# EAGLE design C64_PS (EAGLE 9.5.2)
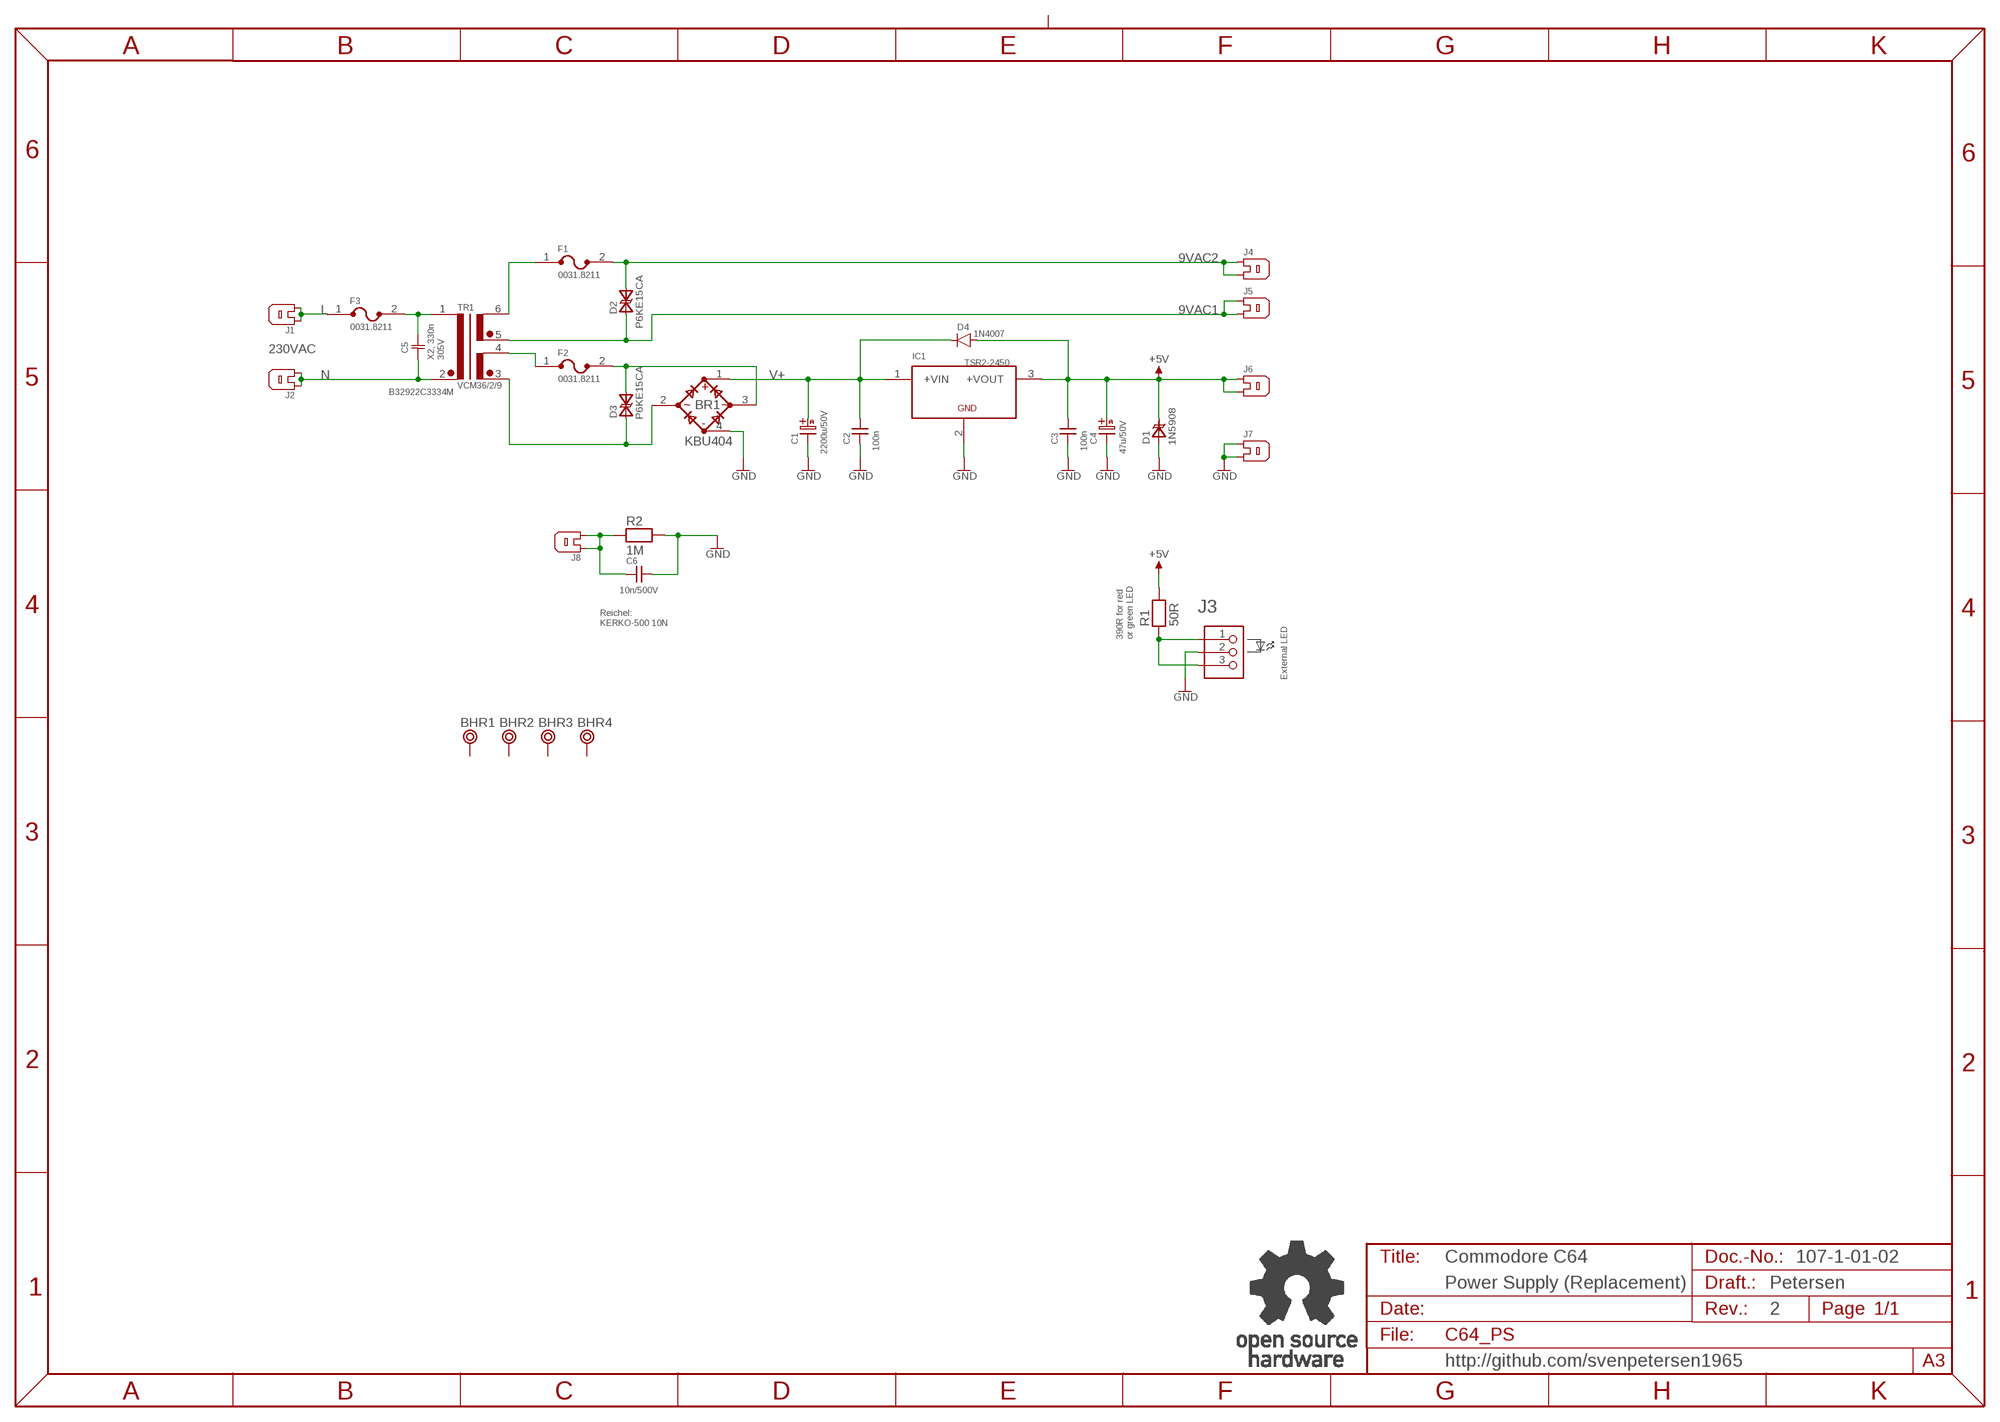
[diagram p0: schematic, sheet 1]

## Parts
BHR1  BOHR3,3  [BOHR3,3]
BHR2  BOHR3,3  [BOHR3,3]
BHR3  BOHR3,3  [BOHR3,3]
BHR4  BOHR3,3  [BOHR3,3]
BR1  KBU404  [KBU]
C1  2200u/50V  C18/7,5  [C18/7,5]
C2  100n  CAP02  [C-5]
C3  100n  CAP02  [C-5]
C4  47u/50V  C07/2,5  [C07/2,5]
C5  B32922C3334M  X2--RM15-18X8  [C-18X8-RM15]
C6  10n/500V  CAP02  [C-5]
D1  1N5908  [CB429]
D2  P6KE15CA  [CB417]
D3  P6KE15CA  [CB417]
D4  1N4007  [DO-41]
F1  0031.8211  [0031.8211]
F2  0031.8211  [0031.8211]
F3  0031.8211  [0031.8211]
IC1  TSR2-2450  TSR2  [TSR2]
J1  FLA6,3  [FLA6,3]
J2  FLA6,3  [FLA6,3]
J3  PINHD-1X3  [1X03]
J4  FLA6,3  [FLA6,3]
J5  FLA6,3  [FLA6,3]
J6  FLA6,3  [FLA6,3]
J7  FLA6,3  [FLA6,3]
J8  FLA6,3  [FLA6,3]
R1  50R  RES04  [R-10]
R2  1M  RES04  [R-10]
TR1  VCM36/2/9  [VCM36_2_9]
U$17  OPEN_SOURCE_HW  [OPENHW]

## Nets
9VAC1: D2.A(A1) J5.1 J5.2 TR1.5(SEC12)
9VAC2: D2.K(A2) F1.2 J4.1 J4.2
+5V: C3.2 C4.A(+) D1.K D4.A IC1.3(+VOUT) J6.1 J6.2 R1.2
GND: BR1.4(-) C1.- C2.1 C3.1 C4.K(-) C6.2 D1.A IC1.2(GND) J3.2 J7.1 J7.2 R2.2
L: F3.1 J1.1 J1.2
N [mains]: C5.1 J2.1 J2.2 TR1.2(PRI2)
N$1: F1.1 TR1.6(SEC11)
N$2: J3.1 J3.3 R1.1
N$3: F2.1 TR1.4(SEC21)
N$4: BR1.2(AC1) D3.A(A1) TR1.3(SEC22)
N$5: BR1.3(AC2) D3.K(A2) F2.2
N$7 [mains]: C5.2 F3.2 TR1.1(PRI1)
PE: C6.1 J8.1 J8.2 R2.1
V+: BR1.1(+) C1.+ C2.2 D4.K IC1.1(+VIN)
Unconnected: BHR1.P$1 BHR2.P$1 BHR3.P$1 BHR4.P$1

## Notes on the sheet
- 230VAC
- X2, 330n
  305V
- Reichel:
  KERKO-500 10N
- 390R for red
  or green LED
- External LED
- Commodore C64 | 107-1-01-02
- Power Supply (Replacement) | Petersen
- 2
- http://github.com/svenpetersen1965

## Library data of the parts
BHR1-BHR4 = Mech_Bohr:BOHR3,3
BR1 = HY:KBU404
C1 = ELCO:C18/7,5: Radialer Alu-Elko, Durchm. 18mm, RM 7,5
C2 C3 C6 = DISCRETE:CAP02
C4 = ELCO:C07/2,5
C5 = Epcos_EMV:X2-*: X2-Kondensatoren
D1 = ST:1N5908
D2 D3 = ST:P6KE15CA
D4 = Dioden:1N4007
F1-F3 = Schurter:0031.8211
IC1 = Traco:TSR2
J1 J2 J4-J8 = Connect:FLA6,3
J3 = PINHEAD:PINHD-1X3
R1 R2 = DISCRETE:RES04
TR1 = Block:VCM36/2/9
U$17 = Logo:OPEN_SOURCE_HW

## Net classes
1 mains: clearance 5 mm

## Board
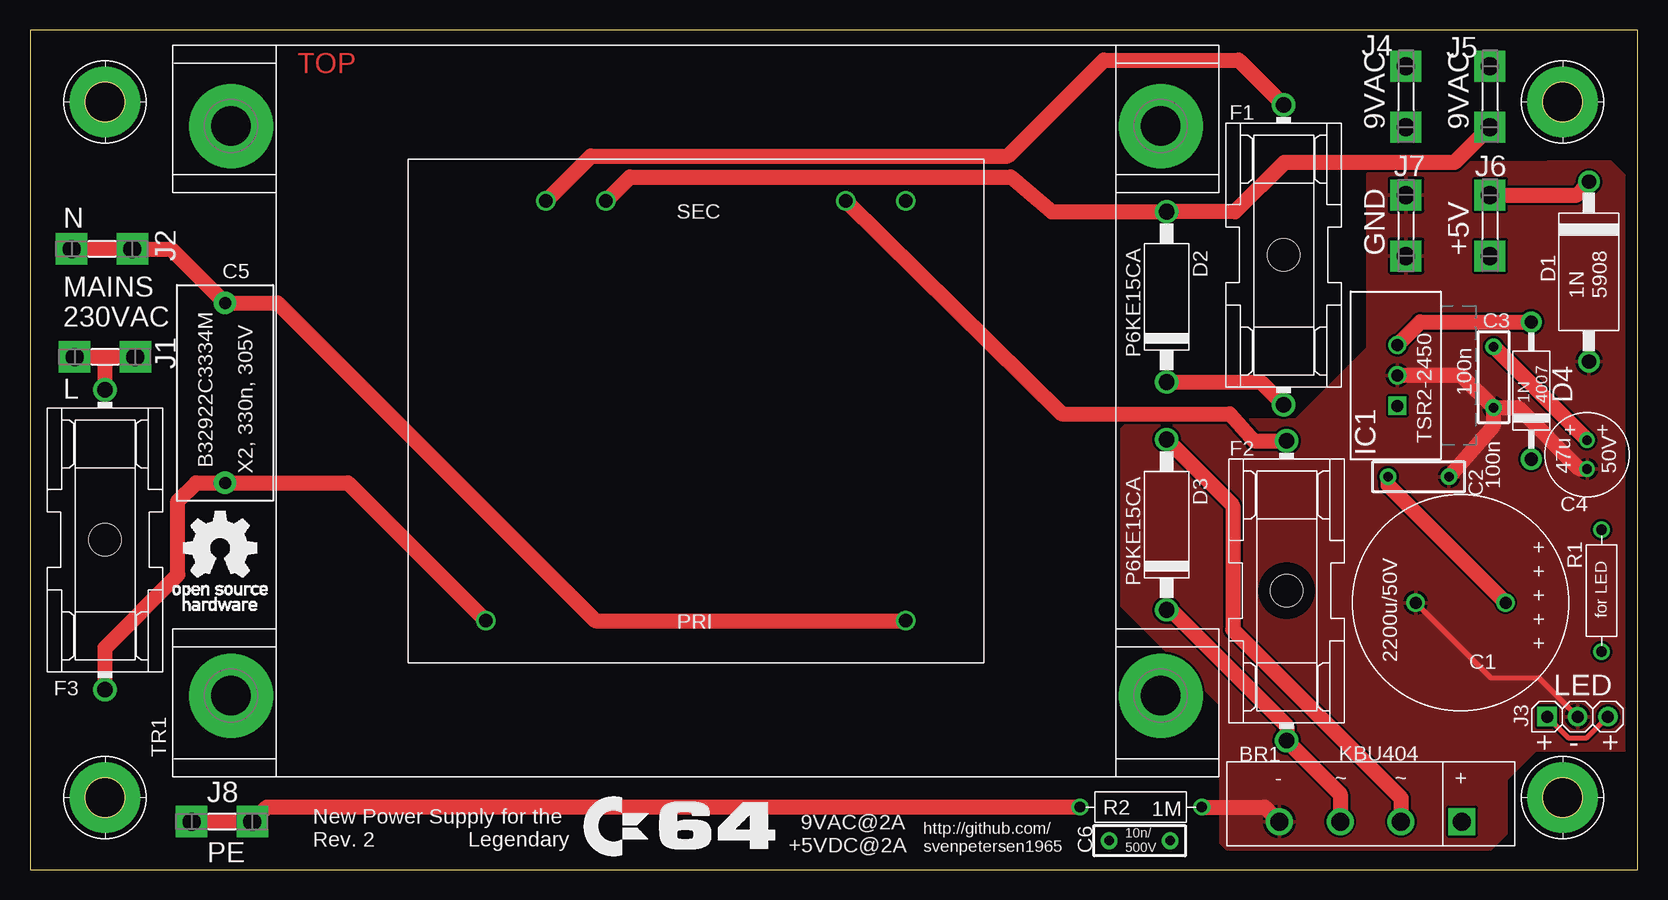
[diagram p1: board, top side]
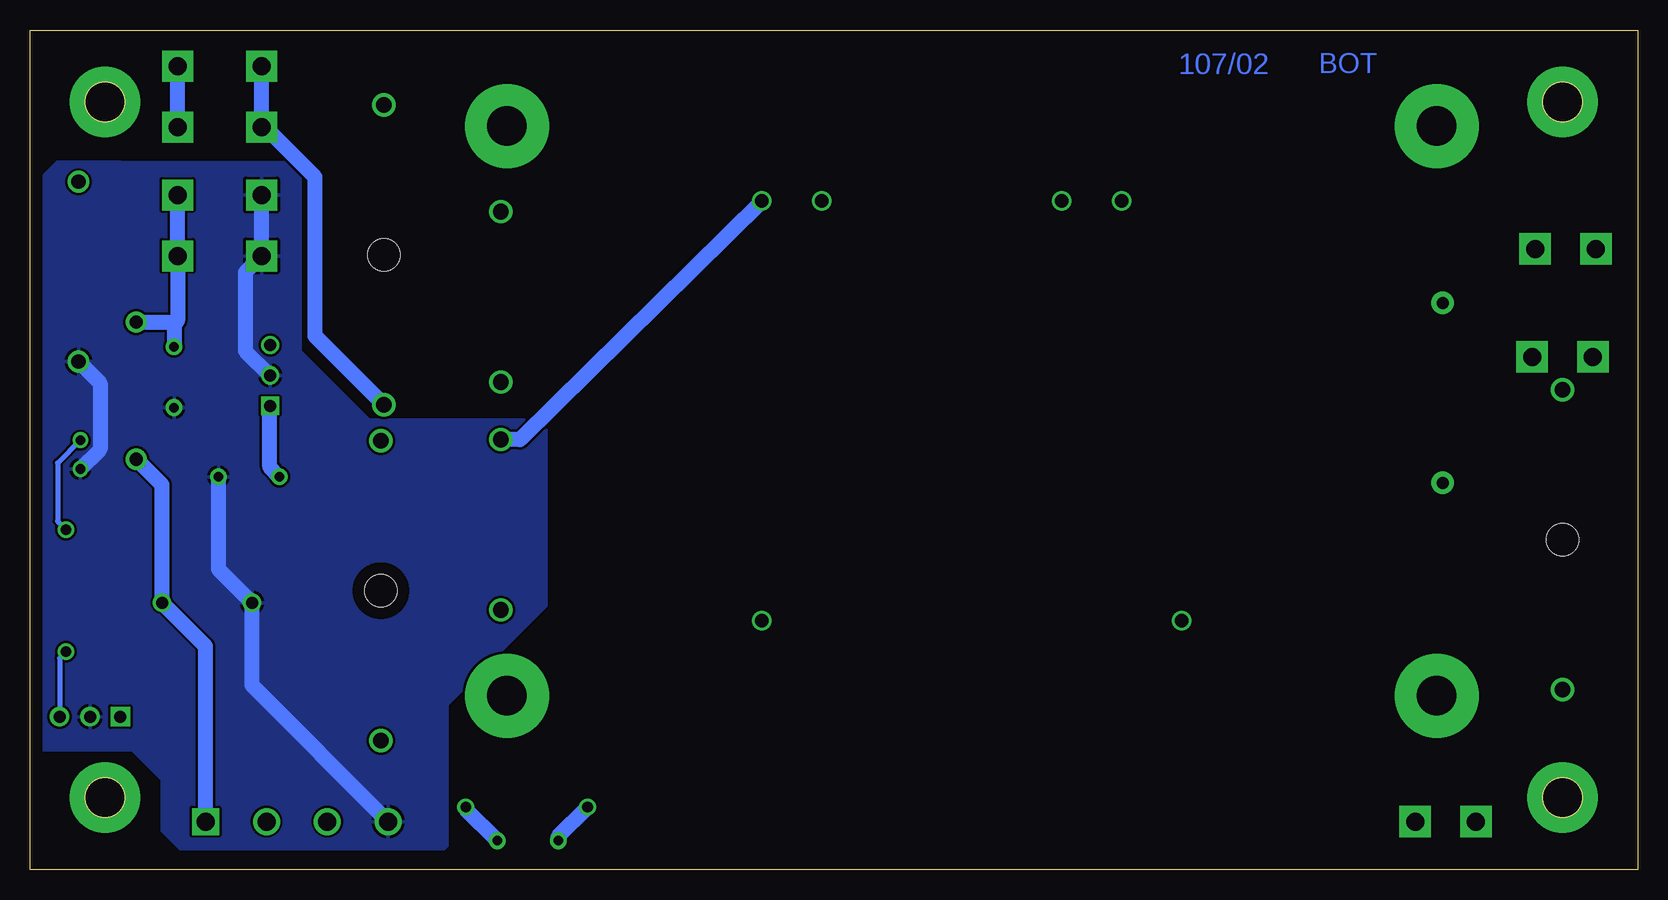
[diagram p2: board, bottom side, seen from below]

Size 134 x 70 mm. Coordinates in mm from the lower left corner, seen from the top.
Outline: 0,0 134,0 134,70 0,70 0,0
Copper layers (1*16): Top 0.035mm / dielectric 1.5mm / Bottom 0.035mm
Design rules "default *": minimum track width 6mil, minimum drill 0.35mm, track to track 8mil, track to pad 8mil, pad to pad 8mil, via to via 8mil, smd to smd 8mil, copper to edge 40mil, drill to drill 6mil, minimum pad ring 10mil, minimum via ring 8mil, stop-mask expansion 4mil, vias tented up to drill 0mil, thermal gap 10mil

### Footprints (pad centres in the part's own frame; a part is rotated, then mirrored left to right if it is on the bottom)
BOHR3,3 = drill 3.302 pad 5.842: P$1 0,0
KBU = drill 1.5 square: 1 7.62,0 | drill 1.5: 2 2.54,0; 3 -2.54,0; 4 -7.62,0
C18/7,5 = drill 1: + -3.75,0; - 3.75,0
C-5 = drill 0.8 pad 1.397: 1 -2.54,0; 2 2.54,0
C07/2,5 = drill 0.813 pad 1.27: A -1.202,0; K 1.202,0
C-18X8-RM15 = drill 1 pad 1.905: 1 -7.5,0; 2 7.5,0
CB429 = drill 1.2: A -7.5,0; K 7.5,0
CB417 = drill 1.3: A -7.1,0; K 7.1,0
DO-41 = drill 1.118 pad 1.778: A 5.715,0; K -5.715,0
0031.8211 = drill 1.3: 1 -12.5,0; 2 12.5,0 | hole 2.7: 0,0
TSR2 = drill 1 square: 1 -2.54,0 | drill 1: 2 0,0; 3 2.54,0
FLA6,3 = drill 1.5 pad 2.591 square: 1 -2.54,0; 2 2.54,0
1X03 = drill 1 pad 1.626 square: 1 -2.54,0 | drill 1 pad 1.626: 2 0,0; 3 2.54,0
R-10 = drill 0.889 pad 1.397: 1 -5.08,0; 2 5.08,0
VCM36_2_9 = drill 1.1: 1 -17.5,-17.5; 2 17.5,-17.5; 3 17.5,17.5; 4 12.5,17.5; 5 -7.5,17.5; 6 -12.5,17.5 | drill 3.3 pad 7: M1 -38.75,-23.75; M2 38.75,-23.75; M3 38.75,23.75; M4 -38.75,23.75

### Placement (x,y rotation side)
BHR1  6.25,6 0 top
BHR2  6.25,64 0 top
BHR3  127.75,6 0 top
BHR4  127.75,64 0 top
BR1  111.75,4 0 top
C1  119.25,22.25 180 top
C2  115.75,32.75 180 top
C3  122,41.05 90 top
C4  129.79,34.6 270 top
C5  16.25,39.75 270 top
C6  92.5,2.4 0 top
D1  129.95,49.85 90 top
D2  94.75,47.75 270 top
D3  94.75,28.75 270 top
D4  125.15,39.93 90 top
F1  104.5,51.25 270 top
F2  104.75,23.25 270 top
F3  6.25,27.5 270 top
IC1  113.98,41.2 90 top
J1  6.25,42.75 0 top
J2  6,51.75 0 top
J3  129,12.75 0 top
J4  114.7,64.45 90 top
J5  121.7,64.45 90 top
J6  121.7,53.7 90 top
J7  114.7,53.7 270 top
J8  16,4 0 top
R1  131,23.25 90 top
R2  92.6,5.2 0 top
TR1  55.5,38.25 0 top
U$13  [PCB-TITLE/]  -0.16,72.71 0 top
U$14  [2LAYER]  22.3,66.4 0 top
U$15  [C64_LOGO]  46.16,1.11 0 top
U$17  11.91,21.59 0 top

### Tracks (layer width: path | path; a pad name or v marks a point on that pad's centre or on a via)
9VAC1
  Top 1.27: J5.1 118.74,58.95 104.55,58.95 100.45,54.85 D2.A 85.15,54.85 81.75,57.75 50,57.75 TR1.5
  Bottom 1.27: J5.1 J5.2
9VAC2
  Top 1.27: D2.K 102.6,40.65 F1.2
  Bottom 1.27: F1.2 110.25,44.5 110.25,57.75 114.41,61.91 J4.1 J4.2
+5V
  Top 1.27: J6.2 128.96,56.24 D1.K | C4.A C3.2 | IC1.3 115.89,45.65 D4.A
  Bottom 0.406: C4.A 131.7,33.9 131.7,29.03 R1.2
  Bottom 1.27: C3.2 122,45.47 121.82,45.65 | J6.2 J6.1 121.7,45.77 121.82,45.65 | D4.A 121.82,45.65
GND
  Top 0.406: C1.- 121.75,16 125.75,16 J3.2
  Top 1.27: C2.1 122,37.04 C3.1 | C3.1 124.04,38.51 129.16,33.4 C4.K | IC1.2 119.31,41.2 C3.1 | R2.2 102.93,5.2 BR1.4
  Bottom 1.27: BR1.4 115.5,15.37 C1.- 118.29,25.04 C2.1 | J7.1 J7.2 116.05,49.81 116.05,43.25 114,41.2 | D1.A 128.15,40.55 128.15,35.04 C4.K | C6.2 97.68,5.04 R2.2
  pour Bottom: 99.5,1.75 99.25,2 99.25,13.75 91,22 91,36.75 91.75,37.5 105.75,37.5 111.5,43.25 111.5,58 112.45,58.95 126.45,58.95 126.5,59 131.75,59 133,57.75 133,10 125.5,10 123,7.5 123,3.25 121.5,1.75
  pour Top: 99.75,1.75 99.25,2.25 99.25,13.75 91,22 91,36.75 91.75,37.5 105.5,37.5 111.5,43.5 111.5,58 112.45,58.95 126.45,58.95 126.5,59 131.75,59 133,57.75 133,10 125.5,10 123,7.5 123,3 121.75,1.75
L
  Top 1.27: J1.1 6.25,42.75 | 6.25,42.75 J1.2 | F3.1 6.25,42.75
N
  Top 1.27: J2.1 J2.2 11.75,51.75 C5.1 20.64,47.25 47.14,20.75 TR1.2
N$1
  Top 1.27: TR1.6 46.75,59.5 81.5,59.5 89.5,67.5 100.75,67.5 F1.1
N$2
  Top 0.406: J3.1 128.21,11 129.79,11 J3.3
  Bottom 0.406: R1.1 131.54,17.63 J3.3
N$3
  Top 1.27: TR1.4 86,38 100,38 102,35.75 F2.1
N$4
  Top 1.27: D3.A 100.25,30.35 100.25,20 114.29,5.96 BR1.2
  Bottom 1.27: TR1.3 93.15,35.85 D3.A
N$5
  Top 1.27: BR1.3 109.21,6.29 F2.2 104.75,12 95.1,21.65 D3.K
N$7
  Top 1.27: F3.2 6.25,18.5 12.32,24.57 12.32,30.73 13.84,32.25 C5.2 26.5,32.25 TR1.1
PE
  Top 1.27: R2.1 19.74,5.2 J8.2 J8.1
  Bottom 1.27: C6.1 89.96,2.76 R2.1
V+
  Top 1.27: C1.+ 113.21,32.04 C2.2
  Bottom 1.27: BR1.1 119.37,18.62 C1.+ 123,32.07 D4.K | C2.2 114,33.54 114,38.65 IC1.1

### Text on the board
Bottom: 107/02
tPlace: 9VAC | 9VAC | N | P6KE15CA | GND | +5V | 1N / 5908 | MAINS / 230VAC | 100n | L | 1N / 4007 | TSR2-2450 | B32922C3334M | X2, 330n, 305V | P6KE15CA | 47u | 50V | 100n | for LED | 2200u/50V | LED | + | - | + | KBU404 | 1M | New Power Supply for the / Rev. 2 | Legendary | PE | 9VAC@2A / +5VDC@2A | http://github.com/ / svenpetersen1965 | 10n/ / 500V
tValues: X2, 330n, 305V
Measures: 3.3
Document: Sven Petersen | 107-2-01-02 | 2019 | 35µm | 2 | 2